# Altium schematic sheet P1.schdoc
size 420 x 297 mm; Symbol: Sheet-Symbol_A4; Company: 嘉立创EDA; Version: V1.0; Page Size: A4; @Project Name: ArmourK08小智音响（1.54寸屏-充电可开关机版); @Page Count: 1; @Update Date: 2025-05-19; @Create Date: 2025-05-09; @Schematic Name: armourk08小智音响（1.54寸屏-充电可开关机版irony)原理图; @Page No: 1; @Page Name: P1; Device: Sheet-Symbol_A4; @Board Name: ArmourK08小智音响（1.54寸屏-充电可开关机版irony); @Create Time: 15:40:17; @Update Time: 10:11:29; Border: 1; Width: 1655; Height: 1170; Region Start: 1; X Region Count: 6; Y Region Count: 4; Blade Width: 10; Title Block Position: 3
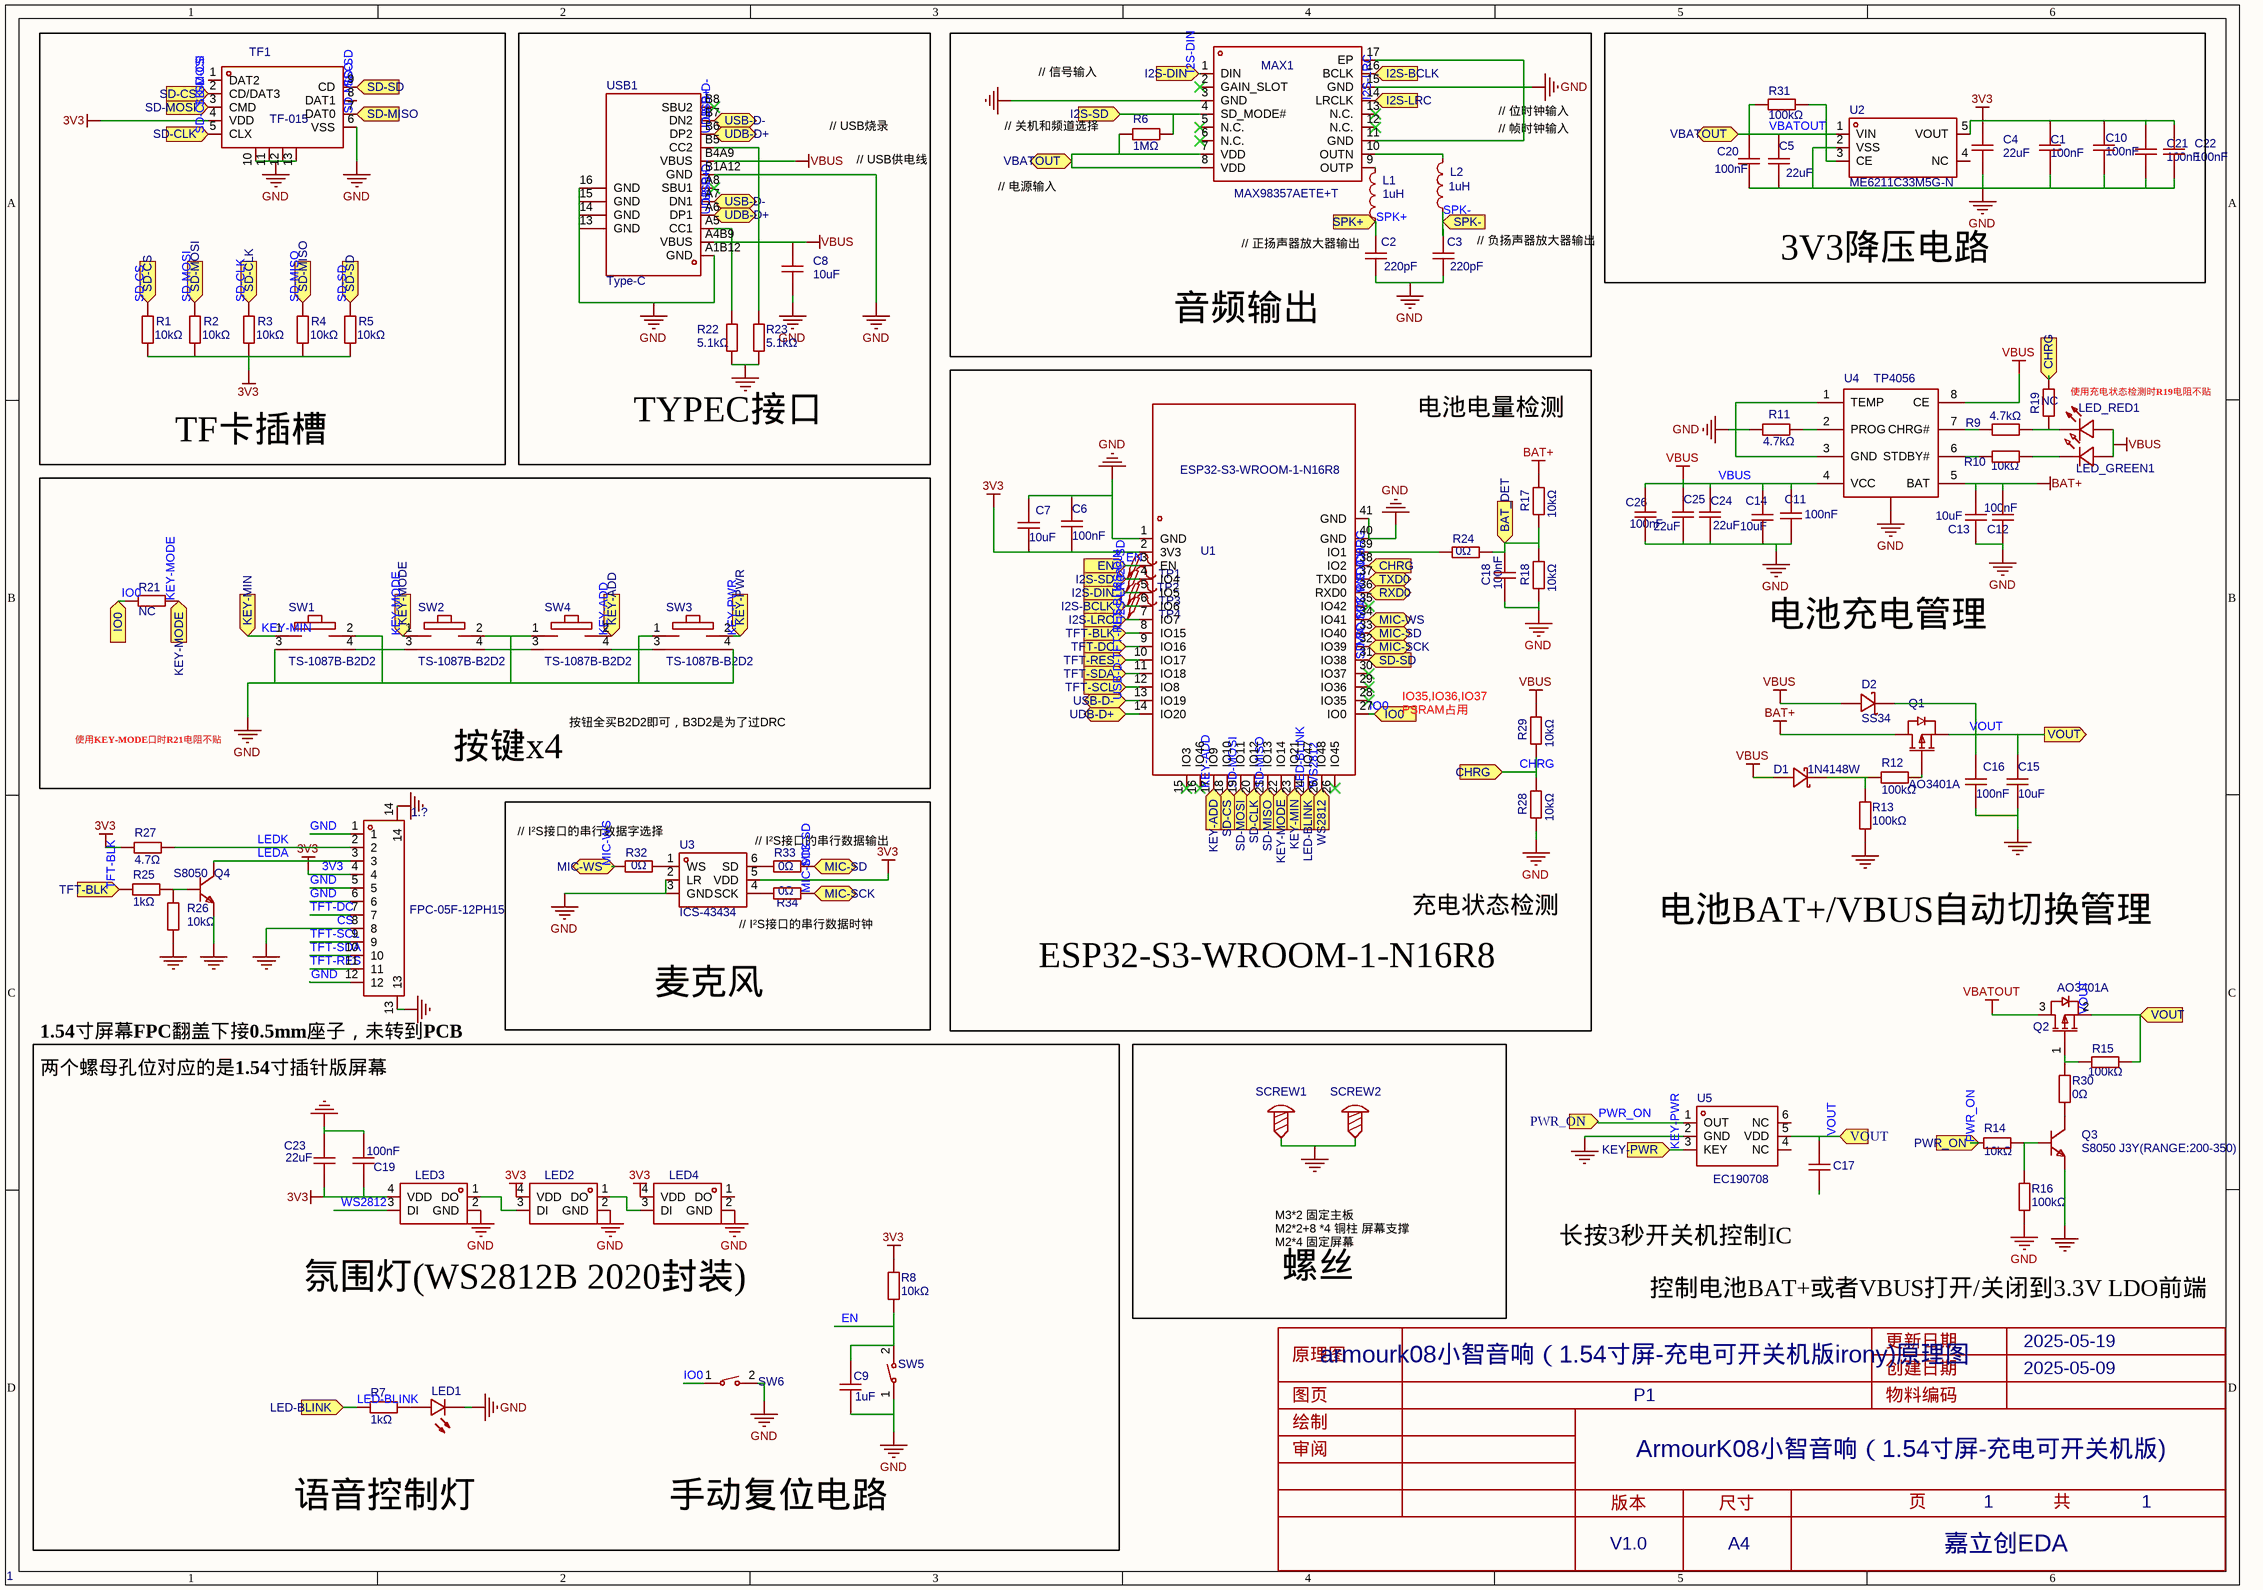
[diagram p0: P1.schdoc]

## Parts
1.?  FPC-05F-12PH15  [FPC-SMD_12P-P0.50_XUNPU_FPC-05F-12PH15]
C1  100nF  [C0603]
C2  220pF  [C0603]
C3  220pF  [C0603]
C4  22uF  [C0805]
C5  22uF  [C0805]
C6  100nF  [C0603]
C7  10uF  [C0603]
C8  10uF  [C0603]
C9  1uF  [C0603]
C10  100nF  [C0603]
C11  100nF  [C0603]
C12  100nF  [C0603]
C13  10uF  [C0805]
C14  10uF  [C0805]
C15  10uF  [C0805]
C16  100nF  [C0603]
C17  CC0603KRX7R9BB104  [C0603]  (value not drawn)
C18  100nF  [C0603]
C19  100nF  [C0603]
C20  100nF  [C0603]
C21  100nF  [C0603]
C22  100nF  [C0603]
C23  22uF  [C0805]
C24  22uF  [C0805]
C25  22uF  [C0805]
C26  100nF  [C0603]
D1  1N4148W  [SOD-123_L2.7-W1.6-LS3.7-FD]
D2  SS34  [SMA_L4.3-W2.6-LS5.2-RD]
L1  1uH  [L0603]
L2  1uH  [L0603]
LED1  NCD0603G1  [LED0603-RD-YELLOW]  (value not drawn)
LED2  WS2812C-2020-V1  [LED-SMD_4P-L2.0-W2.0-TL_WS2812B-2020]  (value not drawn)
LED3  WS2812C-2020-V1  [LED-SMD_4P-L2.0-W2.0-TL_WS2812B-2020]  (value not drawn)
LED4  WS2812C-2020-V1  [LED-SMD_4P-L2.0-W2.0-TL_WS2812B-2020]  (value not drawn)
LED_GREEN1  XL-1608PGC-06  [LED0603-RD_GREEN]  (value not drawn)
LED_RED1  KT-0603R  [LED0603-RD]  (value not drawn)
MAX1  MAX98357AETE+T  [TQFN-16_L3.0-W3.0-P0.50-BL-EP1.1]
Q1  AO3401A  [SOT-23_L2.9-W1.3-P1.90-LS2.4-BR]
Q2  AO3401A  [SOT-23_L2.9-W1.3-P1.90-LS2.4-BR]
Q3  S8050 J3Y(RANGE:200-350)  [SOT-23-3_L3.0-W1.7-P0.95-LS2.9-BR]
Q4  S8050  [SOT-23-3_L2.9-W1.3-P1.90-LS2.3-BR]
R1  10kΩ  [R0603]
R2  10kΩ  [R0603]
R3  10kΩ  [R0603]
R4  10kΩ  [R0603]
R5  10kΩ  [R0603]
R6  1MΩ  [R0603]
R7  1kΩ  [R0603]
R8  10kΩ  [R0603]
R9  4.7kΩ  [R0603]
R10  10kΩ  [R0603]
R11  4.7kΩ  [R0603]
R12  100kΩ  [R0603]
R13  100kΩ  [R0603]
R14  10kΩ  [R0603]
R15  100kΩ  [R0603]
R16  100kΩ  [R0603]
R17  10kΩ  [R0603]
R18  10kΩ  [R0603]
R19  NC  [R0402]
R21  NC  [R0603]
R22  5.1kΩ  [R0603]
R23  5.1kΩ  [R0603]
R24  0Ω  [R0603]
R25  1kΩ  [R0603]
R26  10kΩ  [R0603]
R27  4.7Ω  [R0603]
R28  10kΩ  [R0603]
R29  10kΩ  [R0603]
R30  0Ω  [R0603]
R31  100kΩ  [R0603]
R32  0Ω  [R0603]
R33  0Ω  [R0603]
R34  0Ω  [R0603]
SCREW1  (no value)  [M3螺丝]
SCREW2  (no value)  [M3螺丝]
SW1  TS-1087B-B2D2  [KEY-SMD_4P-L7.8-W2.8-P4.20-EH]
SW2  TS-1087B-B2D2  [KEY-SMD_4P-L7.8-W2.8-P4.20-EH]
SW3  TS-1087B-B2D2  [KEY-SMD_4P-L7.8-W2.8-P4.20-EH]
SW4  TS-1087B-B2D2  [KEY-SMD_4P-L7.8-W2.8-P4.20-EH]
SW5  TC-S3403-2.0-260G  [SW-SMD_L4.0-W3.0-LS5.0]  (value not drawn)
SW6  TC-S3403-2.0-260G  [SW-SMD_L4.0-W3.0-LS5.0]  (value not drawn)
TF1  TF-015  [TF-SMD_TF-015]
TP1  (no value)  [Test-Point-0.5mm]
TP2  (no value)  [Test-Point-0.5mm]
TP3  (no value)  [Test-Point-0.5mm]
TP4  (no value)  [Test-Point-0.5mm]
U1  ESP32-S3-WROOM-1-N16R8  [WIRELM-SMD_ESP32-S3-WROOM-1]
U2  ME6211C33M5G-N  [SOT-23-5_L3.0-W1.7-P0.95-LS2.8-BL]
U3  ICS-43434  [MIC-SMD_6P-L3.5-W2.7-P0.90-BL]
U4  TP4056  [ESOP-8_L4.9-W3.9-P1.27-LS6.0-BL-EP]
U5  EC190708  [SOT-23-6_L2.9-W1.6-P0.95-LS2.8-BL]
USB1  Type-C  [USB-C-SMD_TYPEC-304-BCP16]

## Blocks framed on the sheet
TF卡插槽: R1-R5 TF1
TYPEC接口: C8 R22 R23 USB1
音频输出: C2 C3 L1 L2 MAX1 R6
3V3降压电路: C1 C4 C5 C10 C20-C22 R31 U2
ESP32-S3-WROOM-1-N16R8: C6 C7 C18 R17 R18 R24 R28 R29 TP1-TP4 U1
按键x4: R21 SW1-SW4
麦克风: R32-R34 U3
螺丝: SCREW1 SCREW2

## Ports
BAT_DET (in), CHRG (in), EN (in), I2S-BCLK (in), I2S-DIN (in), I2S-LRC (in), I2S-SD (in), IO0 (in), KEY-ADD (in), KEY-MIN (in), KEY-MODE (in), KEY-PWR (in), LED-BLINK (in), MIC-SCK (bidir), MIC-SD (bidir), MIC-WS (bidir), PWR_ON (in), RXD0 (bidir), SD-CLK (in), SD-CS (in), SD-MISO (in), SD-MOSI (in), SD-SD (in), SPK+ (in), SPK- (in), TFT-BLK (in), TFT-DC (in), TFT-RES (in), TFT-SCL (in), TFT-SDA (in), TXD0 (bidir), UDB-D+ (bidir), USB-D- (bidir), VBATOUT (bidir), VOUT (in), VOUT (out), WS2812 (in)

## Nets
3V3: 1.?.4 C1.2 C4.2 C6.1 C7.1 C10.2 C19.1 C21.2 C22.2 C23.1 LED2.4(VDD) LED3.4(VDD) LED4.4(VDD) R1.1 R2.1 R3.1 R4.1 R5.1 R8.2 R27.1 TF1.4(VDD) U1.2(3V3) U2.5(VOUT) U3.5(VDD)
BAT+: C12.1 C13.1 Q1.3(D) R17.2 U4.5(BAT)
CS: 1.?.1 1.?.5 1.?.6 1.?.8 1.?.12 1.?.13 1.?.14 C1.1 C2.1 C3.1 C4.1 C5.1 C6.2 C7.2 C8.1 C9.1 C10.1 C11.2 C12.2 C13.2 C14.2 C15.1 C16.1 C18.1 C19.2 C20.1 C21.1 C22.1 C23.2 C24.1 C25.1 C26.1 LED1.1(C) LED2.2(GND) LED3.2(GND) LED4.2(GND) MAX1.3(GND) MAX1.11(GND) MAX1.15(GND) MAX1.17(EP) Q3.2(E) Q4.2(E) R11.2 R13.2 R16.2 R18.1 R22.1 R23.1 R26.1 R28.1 SCREW1.1 SCREW2.1 SW1.2 SW1.3 SW1.4 SW2.2 SW2.3 SW2.4 SW3.1 SW3.3 SW3.4 SW4.1 SW4.3 SW4.4 SW5.1 SW6.2 TF1.6(VSS) TF1.10(EP) TF1.11(EP) TF1.12(EP) TF1.13(EP) U1.1(GND) U1.40(GND) U1.41(GND) U2.2(VSS) U3.2(LR) U3.3(GND) U4.1(TEMP) U4.3(GND) U4.9 U5.2(GND) USB1.13(GND) USB1.14(GND) USB1.15(GND) USB1.16(GND) USB1.A1B12(GND) USB1.B1A12(GND)  [also labelled GND]
VBATOUT: C5.2 C20.2 MAX1.7(VDD) MAX1.8(VDD) Q2.3(D) R6.1 R31.2 U2.1(VIN) ; port VBATOUT
VBUS: C8.2 C11.1 C14.1 C24.2 C25.2 C26.2 D1.1(A) D2.2(A) LED_GREEN1.2(A) LED_RED1.2(A) R29.2 U4.4(VCC) U4.8(CE) USB1.A4B9(VBUS) USB1.B4A9(VBUS)
BAT_DET: C18.2 R17.1 R18.2 R24.2 ; port BAT_DET
CHRG: R19.1 R28.2 R29.1 U1.38(IO2) ; port CHRG
EN: C9.2 R8.1 SW5.2 U1.3(EN) ; port EN
I2S-BCLK: MAX1.16(BCLK) TP3.1 U1.6(IO6) ; port I2S-BCLK
I2S-DIN: MAX1.1(DIN) TP2.1 U1.5(IO5) ; port I2S-DIN
I2S-LRC: MAX1.14(LRCLK) TP4.1 U1.7(IO7) ; port I2S-LRC
I2S-SD: MAX1.4(SD_MODE#) R6.2 TP1.1 U1.4(IO4) ; port I2S-SD
IO0: R21.1 SW6.1 U1.27(IO0) ; port IO0
KEY-ADD: SW4.2 U1.17(IO9) ; port KEY-ADD
KEY-MIN: SW1.1 U1.23(IO21) ; port KEY-MIN
KEY-MODE: R21.2 SW2.1 U1.22(IO14) ; port KEY-MODE
KEY-PWR: SW3.2 U5.3(KEY) ; port KEY-PWR
LED-BLINK: R7.1 U1.24(IO47) ; port LED-BLINK
LEDA: 1.?.3 Q4.3(C)
LEDK: 1.?.2 R27.2
MIC-SCK: R34.2 U1.32(IO39) ; port MIC-SCK
MIC-SD: R33.2 U1.33(IO40) ; port MIC-SD
MIC-WS: R32.1 U1.34(IO41) ; port MIC-WS
PWR_ON: R14.1 U5.1(OUT) ; port PWR_ON
RXD0: U1.36(RXD0) ; port RXD0
SD-CLK: R3.2 TF1.5(CLX) U1.20(IO12) ; port SD-CLK
SD-CS: R1.2 TF1.2(CD/DAT3) U1.18(IO10) ; port SD-CS
SD-MISO: R4.2 TF1.7(DAT0) U1.21(IO13) ; port SD-MISO
SD-MOSI: R2.2 TF1.3(CMD) U1.19(IO11) ; port SD-MOSI
SD-SD: R5.2 TF1.9(CD) U1.31(IO38) ; port SD-SD
SPK+: C2.2 L1.1 ; port SPK+
SPK-: C3.2 L2.1 ; port SPK-
TFT-BLK: R25.1 U1.8(IO15) ; port TFT-BLK
TFT-DC: U1.9(IO16) ; port TFT-DC
TFT-DC: 1.?.7  [a separate net that carries the same name]
TFT-RES: 1.?.11 U1.10(IO17) ; port TFT-RES
TFT-SCL: U1.12(IO8) ; port TFT-SCL
TFT-SCL: 1.?.9  [a separate net that carries the same name]
TFT-SDA: U1.11(IO18) ; port TFT-SDA
TFT-SDA: 1.?.10  [a separate net that carries the same name]
TXD0: U1.37(TXD0) ; port TXD0
UDB-D+: U1.14(IO20) USB1.A6(DP1) USB1.B6(DP2) ; port UDB-D+
USB-D-: U1.13(IO19) USB1.A7(DN1) USB1.B7(DN2) ; port USB-D-
VOUT: C15.2 C16.2 C17.1 D2.1(K) Q1.2(S) Q2.2(S) R15.2 U5.5(VDD) ; port VOUT
WS2812: LED3.3(DI) U1.25(IO48) ; port WS2812
NetD1_2: D1.2(K) R12.2 R13.1
NetL1_2: L1.2 MAX1.9(OUTP)
NetL2_2: L2.2 MAX1.10(OUTN)
NetLED1_2: LED1.2(A) R7.2
NetLED2_1: LED2.1(DO) LED4.3(DI)
NetLED2_3: LED2.3(DI) LED3.1(DO)
NetLED_GREEN1_1: LED_GREEN1.1(K) R10.1
NetLED_RED1_1: LED_RED1.1(K) R9.1 R19.2
NetQ1_1: Q1.1(G) R12.1
NetQ2_1: Q2.1(G) R15.1 R30.2
NetQ3_1: Q3.1(B) R14.2 R16.1
NetQ3_3: Q3.3(C) R30.1
NetQ4_1: Q4.1(B) R25.2 R26.2
NetR9_2: R9.2 U4.7(CHRG#)
NetR10_2: R10.2 U4.6(STDBY#)
NetR11_1: R11.1 U4.2(PROG)
NetR22_2: R22.2 USB1.A5(CC1)
NetR23_2: R23.2 USB1.B5(CC2)
NetR24_1: R24.1 U1.39(IO1)
NetR31_1: R31.1 U2.3(CE)
NetR32_2: R32.2 U3.1(WS)
NetR33_1: R33.1 U3.6(SD)
NetR34_1: R34.1 U3.4(SCK)

Not connected (* = marked no-connect by the designer): C17 2; LED4 1(DO); MAX1 2(GAIN_SLOT)* 5(N.C.)* 6(N.C.)* 12(N.C.)* 13(N.C.)*; TF1 1(DAT2) 8(DAT1); U1 15(IO3)* 16(IO46)* 26(IO45)* 28(IO35)* 29(IO36)* 30(IO37)* 35(IO42)*; U2 4(NC); U5 4(NC) 6(NC); USB1 A8(SBU1)* B8(SBU2)*

## Notes on the sheet
- // USB烧录
- // 关机和频道选择
- // 信号输入
- // 位时钟输入
- // USB供电线
- // 电源输入
- // 帧时钟输入
- // 正扬声器放大器输出
- // 负扬声器放大器输出
- 使用充电状态检测时R19电阻不贴
- 电池电量检测
- 电池充电管理
- 按钮全买B2D2即可，B3D2是为了过DRC
- IO35,IO36,IO37
  PSRAM占用
- 使用KEY-MODE口时R21电阻不贴
- (near R32) // I²S接口的串行数据字选择
- // I²S接口的串行数据输出
- // I²S接口的串行数据时钟
- 充电状态检测
- 电池BAT+/VBUS自动切换管理
- 1.54寸屏幕FPC翻盖下接0.5mm座子，未转到PCB
- 两个螺母孔位对应的是1.54寸插针版屏幕
- M3*2 固定主板
  M2*2+8 *4 铜柱 屏幕支撑
  M2*4 固定屏幕
- 长按3秒开关机控制IC
- 氛围灯(WS2812B 2020封装)
- 控制电池BAT+或者VBUS打开/关闭到3.3V LDO前端
- 语音控制灯
- 手动复位电路
- 更新日期
- 2025-05-19
- 原理图
- 图页
- armourk08小智音响（1.54寸屏-充电可开关机版irony)原理图
- P1
- 创建日期
- 物料编码
- 2025-05-09
- 审阅
- 绘制
- ArmourK08小智音响（1.54寸屏-充电可开关机版)
- 版本
- V1.0
- 尺寸
- A4
- 页
- 1
- 嘉立创EDA
- 共

## Library data of the parts
1.? = FPC-05F-12PH15: 锁定特性:翻盖式;触点类型:下接;触点数量:12P;间距:0.5mm;安装类型:卧贴;工作温度范围:-25℃~+85℃;; Manufacturer: XUNPU(讯普); Convert to PCB: no; AddInBom: yes; ModelId: c5b276ae812f4b41b7fd8ec7fca5fefb; ModelTransform: 397.637,192.913,0,0,0,0,-0.001,-33.465,0; Locking Feature: 翻盖式; Number of Contacts: 12P; Pitch: 0.5mm; FFC, FCB Thickness: 0.3mm; Symbol: FPC-05F-12PH15; Device: FPC-05F-12PH15; LCSC Part Name: 间距:0.5mm P数:12P 翻盖式 下接; SupplierPart: C2856817; ManufacturerPart: FPC-05F-12PH15; Supplier Footprint: SMD,P=0.5mm,卧贴; JLCPCB Part Class: Extended Part; Datasheet: https://atta.szlcsc.com/upload/public/pdf/source/20210922/C2856817_FF8E545F713DE01E284DD10C467113AA.pdf; Supplier: LCSC; FootprintName: FPC-SMD_12P-P0.50_XUNPU_FPC-05F-12PH15; ModelName: FPC-SMD_12P-P0.50_XUNPU_FPC-05F-12PH15; Contact Type: 下接; Mounting Type: 卧贴; Height Above Board: 1.5mm; Operating Temperature Range: -25℃~+85℃
C1 C6 C10-C12 C16 C18-C22 = CC0603KRX7R9BB104: 容值:100nF;精度:±10%;额定电压:50V;材质(温度系数):X7R;; Manufacturer: YAGEO(国巨); AddInBom: yes; ModelId: ac125912035d415993ca9572d50418b1; ModelName: C0603_L1.6-W0.8-H0.8; ModelTransform: 62.992,31.496,0,0,0,0,0,0,0; Tolerance: ±10%; Voltage Rated: 50V; Temperature Coefficient: X7R; Symbol: CC0603KRX7R9BB104; Device: CC0603KRX7R9BB104; LCSC Part Name: 100nF ±10% 50V; SupplierPart: C14663; ManufacturerPart: CC0603KRX7R9BB104; Supplier Footprint: 0603; JLCPCB Part Class: Basic Part; Datasheet: https://atta.szlcsc.com/upload/public/pdf/source/20180910/C282072_33301C7F631E79921B82A8DAC6BCC5B3.pdf; Supplier: LCSC; ConvertToPcb: yes; FootprintName: C0603; Value: 100nF
C2 C3 = CL10B221KB8NNNC: 容值:220pF;精度:±10%;额定电压:50V;材质(温度系数):X7R;; Manufacturer: SAMSUNG(三星); AddInBom: yes; ModelId: ac125912035d415993ca9572d50418b1; ModelName: C0603_L1.6-W0.8-H0.8; ModelTransform: 62.992,31.496,0,0,0,0,0,0,0; Tolerance: ±10%; Voltage Rated: 50V; Temperature Coefficient: X7R; Symbol: CL10B221KB8NNNC; Device: CL10B221KB8NNNC; LCSC Part Name: 220pF ±10% 50V; SupplierPart: C1603; ManufacturerPart: CL10B221KB8NNNC; Supplier Footprint: 0603; JLCPCB Part Class: Basic Part; Datasheet: https://atta.szlcsc.com/upload/public/pdf/source/20160218/1457707763339.pdf; Supplier: LCSC; ConvertToPcb: yes; FootprintName: C0603; Value: 220pF
C4 C5 C23-C25 = CL21A226MAQNNNE: 容值:22uF;精度:±20%;额定电压:25V;材质(温度系数):X5R;; Manufacturer: SAMSUNG(三星); AddInBom: yes; ModelId: 1ba041120af144c991958decab20d241; ModelName: C0805_L2.0-W1.3-H1.3; ModelTransform: 78.74,51.181,0,0,0,0,0,0.0005,0; Tolerance: ±20%; Voltage Rated: 25V; Temperature Coefficient: X5R; Symbol: CL21A226MAQNNNE; Device: CL21A226MAQNNNE; LCSC Part Name: 22uF ±20% 25V; SupplierPart: C45783; ManufacturerPart: CL21A226MAQNNNE; Supplier Footprint: 0805; JLCPCB Part Class: Basic Part; Datasheet: https://atta.szlcsc.com/upload/public/pdf/source/20160218/1457707763339.pdf; Supplier: LCSC; ConvertToPcb: yes; FootprintName: C0805; Value: 22uF
C7 = CL10A106KP8NNNC: 容值:10uF;精度:±10%;额定电压:10V;材质(温度系数):X5R;; Manufacturer: SAMSUNG(三星); Symbol: CapAcitance; AddInBom: yes; ModelId: ac125912035d415993ca9572d50418b1; ModelName: C0603_L1.6-W0.8-H0.8; ModelTransform: 62.992,31.496,0,0,0,0,0,0,0; Tolerance: ±10%; Voltage Rated: 10V; Temperature Coefficient: X5R; Device: CL10A106KP8NNNC; LCSC Part Name: 10uF ±10% 10V; SupplierPart: C19702; ManufacturerPart: CL10A106KP8NNNC; Supplier Footprint: 0603; JLCPCB Part Class: Basic Part; Datasheet: https://atta.szlcsc.com/upload/public/pdf/source/20160218/1457707763339.pdf; Supplier: LCSC; ConvertToPcb: yes; FootprintName: C0603; Value: 10uF
C8 = CL10A106KP8NNNC: 容值:10uF;精度:±10%;额定电压:10V;材质(温度系数):X5R;; Manufacturer: SAMSUNG(三星); AddInBom: yes; ModelId: ac125912035d415993ca9572d50418b1; ModelName: C0603_L1.6-W0.8-H0.8; ModelTransform: 62.992,31.496,0,0,0,0,0,0,0; Tolerance: ±10%; Voltage Rated: 10V; Temperature Coefficient: X5R; Symbol: CL10A106KP8NNNC; Device: CL10A106KP8NNNC; LCSC Part Name: 10uF ±10% 10V; SupplierPart: C19702; ManufacturerPart: CL10A106KP8NNNC; Supplier Footprint: 0603; JLCPCB Part Class: Basic Part; Datasheet: https://atta.szlcsc.com/upload/public/pdf/source/20160218/1457707763339.pdf; Supplier: LCSC; ConvertToPcb: yes; FootprintName: C0603; Value: 10uF
C9 = CL10A105KB8NNNC: 容值:1uF;精度:±10%;额定电压:50V;材质(温度系数):X5R;; Manufacturer: SAMSUNG(三星); AddInBom: yes; ModelId: ac125912035d415993ca9572d50418b1; ModelName: C0603_L1.6-W0.8-H0.8; ModelTransform: 62.992,31.496,0,0,0,0,0,0,0; Tolerance: ±10%; Voltage Rated: 50V; Temperature Coefficient: X5R; Symbol: CL10A105KB8NNNC; Device: CL10A105KB8NNNC; LCSC Part Name: 1uF ±10% 50V; SupplierPart: C15849; ManufacturerPart: CL10A105KB8NNNC; Supplier Footprint: 0603; JLCPCB Part Class: Basic Part; Datasheet: https://atta.szlcsc.com/upload/public/pdf/source/20160218/1457707763339.pdf; Supplier: LCSC; ConvertToPcb: yes; FootprintName: C0603; Value: 1uF
C13 C14 = GRM21BR61H106KE43L: 容值:10uF;精度:±10%;额定电压:50V;材质(温度系数):X5R;; Manufacturer: muRata(村田); Symbol: C1210X7R475K630NT; AddInBom: yes; ModelId: 1ba041120af144c991958decab20d241; ModelName: C0805_L2.0-W1.3-H1.3; ModelTransform: 78.74,51.181,0,0,0,0,0,0.0005,0; Tolerance: ±10%; Voltage Rated: 50V; Temperature Coefficient: X5R; Device: GRM21BR61H106KE43L; Supplier Part: C440198; LCSC Part Name: 10uF ±10% 50V; ManufacturerPart: GRM21BR61H106KE43L; Supplier Footprint: 0805; JLCPCB Part Class: Basic Part; Datasheet: https://atta.szlcsc.com/upload/public/pdf/source/20230811/95AAE0C9AF55EDC31B7A4D8B733F534E.pdf; Supplier: LCSC; ConvertToPcb: yes; FootprintName: C0805; Value: 10uF
C15 = GRM21BR61H106KE43L: 容值:10uF;精度:±10%;额定电压:50V;材质(温度系数):X5R;; Manufacturer: muRata(村田); AddInBom: yes; ModelId: 1ba041120af144c991958decab20d241; ModelName: C0805_L2.0-W1.3-H1.3; ModelTransform: 78.74,51.181,0,0,0,0,0,0.0005,0; Tolerance: ±10%; Voltage Rated: 50V; Temperature Coefficient: X5R; Symbol: GRM21BR61H106KE43L; Value: 10uF; Device: GRM21BR61H106KE43L; Supplier Part: C440198; Manufacturer Part: GRM21BR61H106KE43L; JLCPCB Part Class: Basic Part; Supplier: LCSC; LCSC Part Name: 10uF ±10% 50V; Supplier Footprint: 0805; Datasheet: https://atta.szlcsc.com/upload/public/pdf/source/20230811/95AAE0C9AF55EDC31B7A4D8B733F534E.pdf; ConvertToPcb: yes; FootprintName: C0805
C17 = CC0603KRX7R9BB104: 容值:100nF;精度:±10%;额定电压:50V;材质(温度系数):X7R;; Manufacturer: YAGEO(国巨); AddInBom: yes; ModelId: ac125912035d415993ca9572d50418b1; ModelName: C0603_L1.6-W0.8-H0.8; ModelTransform: 62.992,31.496,0,0,0,0,0,0,0; Value: 100nF; Tolerance: ±10%; Voltage Rated: 50V; Temperature Coefficient: X7R; Origin Footprint: C0603; Device: CC0603KRX7R9BB104; Symbol: CC0603KRX7R9BB104; LCSC Part Name: 100nF ±10% 50V; SupplierPart: C14663; ManufacturerPart: CC0603KRX7R9BB104; Supplier Footprint: 0603; JLCPCB Part Class: Basic Part; Datasheet: https://atta.szlcsc.com/upload/public/pdf/source/20180910/C282072_33301C7F631E79921B82A8DAC6BCC5B3.pdf; Supplier: LCSC; ConvertToPcb: yes; FootprintName: C0603
C26 = CC0603KRX7R9BB104: 容值:100nF;精度:±10%;额定电压:50V;材质(温度系数):X7R;; Manufacturer: YAGEO(国巨); Symbol: CL10A105KB8NNNC; AddInBom: yes; ModelId: ac125912035d415993ca9572d50418b1; ModelName: C0603_L1.6-W0.8-H0.8; ModelTransform: 62.992,31.496,0,0,0,0,0,0,0; Tolerance: ±10%; Voltage Rated: 50V; Temperature Coefficient: X7R; Device: CC0603KRX7R9BB104; LCSC Part Name: 100nF ±10% 50V; SupplierPart: C14663; ManufacturerPart: CC0603KRX7R9BB104; Supplier Footprint: 0603; JLCPCB Part Class: Basic Part; Datasheet: https://atta.szlcsc.com/upload/public/pdf/source/20180910/C282072_33301C7F631E79921B82A8DAC6BCC5B3.pdf; Supplier: LCSC; ConvertToPcb: yes; FootprintName: C0603; Value: 100nF
D1 = 1N4148W_C7420318: 二极管配置:独立式;正向压降(Vf):1.25V@150mA;直流反向耐压(Vr):100V;整流电流:150mA;反向恢复时间(trr):4ns;; Manufacturer: 宏迦橙; Symbol: B5819W_C7420330; AddInBom: yes; ModelId: 5054d9b7be8b429dad093a54b517b4dd; ModelTransform: 145.669,61.024,0,0,0,0,0,0,0; Diode Configuration: 独立式; Reverse Voltage (Vr): 100V; Rectified Current: 150mA; Reverse Leakage Current (Ir): 1uA@75V; Reverse Recovery Time (trr): 4ns; Device: 1N4148W_C7420318; Supplier: LCSC; Supplier Part: C7420318; Manufacturer Part: 1N4148W; JLCPCB Part Class: Extended Part; LCSC Part Name: 1N4148W; Supplier Footprint: SOD-123; Datasheet: https://atta.szlcsc.com/upload/public/pdf/source/20230828/E5C3F7A4272052930A7E03B75759BF50.pdf; ConvertToPcb: yes; FootprintName: SOD-123_L2.7-W1.6-LS3.7-FD; ModelName: SOD-123_L2.7-W1.6-LS3.7-FD; Forward Voltage (Vf@If): 1.25V@150mA; Operating Temperature: -55℃~+150℃
D2 = SS34_C8678: 二极管配置:独立式;正向压降(Vf):550mV@3A;直流反向耐压(Vr):40V;整流电流:3A;; Manufacturer: MDD(辰达半导体); AddInBom: yes; ModelId: e3551acb3c5a4975a5e9d36087fe1fa2; ModelTransform: 185.039,102.362,0,0,0,0,0,0,0; Diode Configuration: 独立式; Reverse Voltage (Vr): 40V; Rectified Current: 3A; Reverse Leakage Current (Ir): 500uA@40V; Supplier: LCSC; Supplier Part: C8678; Manufacturer Part: SS34; JLCPCB Part Class: Basic Part; Symbol: SS34_C8678; Device: SS34_C8678; LCSC Part Name: 电压:40V 电流:3A; Supplier Footprint: SMA(DO-214AC); Datasheet: https://atta.szlcsc.com/upload/public/pdf/source/20240710/2118BB86FDDB2E0B294389AC1F3F65C8.pdf; ConvertToPcb: yes; FootprintName: SMA_L4.3-W2.6-LS5.2-RD; ModelName: SMA_L4.3-W2.6-LS5.2-RD; Forward Voltage (Vf@If): 550mV@3A
L1 L2 = MLF1608A1R0JT000: 电感值:1uH;精度:±5%;额定电流:50mA;饱和电流(Isat):-;直流电阻(DCR):250mΩ;; Manufacturer: TDK; AddInBom: yes; ModelId: 2bc5ec593d464d6ba9807aec0b5673c2; ModelName: L0603_L1.6-W0.8-H0.5_BEAD; ModelTransform: 62.992,31.496,0,180,0,0,0.094,0.629,0; Tolerance: ±5%; Rated Current: 50mA; DC Resistance (DCR): 250mΩ; Q @ Freq: 35@10MHz; Frequency - Self Resonant: 120MHz; Symbol: MLF1608A1R0JT000; Device: MLF1608A1R0JT000; LCSC Part Name: 1uH ±5%; SupplierPart: C275338; ManufacturerPart: MLF1608A1R0JT000; Supplier Footprint: 0603; JLCPCB Part Class: Extended Part; Datasheet: https://atta.szlcsc.com/upload/public/pdf/source/20181024/C275360_B1B692DBFC9DEC74C665E44402F50225.pdf; Supplier: LCSC; ConvertToPcb: yes; FootprintName: L0603; Value: 1uH; Saturation Current (Isat): -; Ratings: -
LED1 = NCD0603G1: 发光颜色:翠绿色;正向电压(VF):2.6V~3.6V;功率:72mW;正向电流:10mA;主波长:515nm~530nm;透镜颜色:无色透明透镜;发光强度:330mcd~900mcd;发光角度:130°;工作温度:-30℃~+85℃;; Manufacturer: 国星光电; Symbol: 19-213/Y2C-CQ2R2L/3T(CY); AddInBom: yes; ModelId: 3beb0148d24d477aac1d9f7d4b6d534c; ModelName: LED0603-RD_1; ModelTransform: 62.2046,31.496,0,0,0,0,0.002,0.007,0; Emitted Color: 翠绿色; Power Dissipation: 72mW; Forward Current: 10mA; Lens Color: 无色透明透镜; Viewing Angle: 130°; Device: NCD0603G1; LCSC Part Name: NCD0603G1; SupplierPart: C84267; ManufacturerPart: NCD0603G1; Supplier Footprint: 0603; JLCPCB Part Class: Extended Part; Datasheet: https://atta.szlcsc.com/upload/public/pdf/source/20200820/C84267_04BA7703640BAC111D09F5EFB971FBF3.pdf; Supplier: LCSC; ConvertToPcb: yes; FootprintName: LED0603-RD-YELLOW; Forward Voltage (VF): 2.6V~3.6V; Dominant Wavelength: 515nm~530nm; Luminous Intensity: 330mcd~900mcd; Operating Temperature: -30℃~+85℃
LED2-LED4 = WS2812C-2020-V1: 发光颜色:RGB三色;功率:-;正向电流:-;主波长:624nm；520nm；467nm;二极管配置:-;透镜颜色:-;色温:-;发光角度:-;载带方式:-;工作温度:-;; Manufacturer: worldsemi; AddInBom: yes; ModelId: ec3f1773c2c342958c28fcec35b8a247; ModelName: LED-SMD_4P-L2.0-W2.0-H0.8-TL_WS2812B-2020; ModelTransform: 78.74,78.74,0,0,0,0,0.001,0.005,0; Emitted Color: RGB三色; Symbol: WS2812C-2020-V1; Device: WS2812C-2020-V1; LCSC Part Name: RGB三色; SupplierPart: C2976072; ManufacturerPart: WS2812C-2020-V1; Supplier Footprint: SMD,2x2mm; JLCPCB Part Class: 扩展库; Datasheet: https://atta.szlcsc.com/upload/public/pdf/source/20220222/52A01000447F5320C9A8C3F34CEFDB81.pdf; Supplier: LCSC; ConvertToPcb: yes; FootprintName: LED-SMD_4P-L2.0-W2.0-TL_WS2812B-2020; Power Dissipation: -; Forward Current: -; Dominant Wavelength: 624nm；520nm；467nm; Peak Wavelength: -; Diode Configuration: -; Lens Color: -; Color Temperature: -; Viewing Angle: -; Mounting Sytle: -; Operating Temperature: -
LED_GREEN1 = XL-1608PGC-06: 灯头类型:-;发光颜色:翠绿色;正向电压(VF):2.6V~3V;功率:75mW;正向电流:5mA;主波长:505nm~540nm;二极管配置:-;透镜颜色:绿色透镜;色温:-;发光强度:299mcd;发光角度:130°;载带方式:正贴;工作温度:-;; Manufacturer: XINGLIGHT(成兴光); Origin Footprint: LED0603_GREEN; AddInBom: yes; ModelId: 7761174b67d9475ab0dbce38062fb2f9; ModelTransform: 63.7794,31.496,0,0,0,0,0,0,0; Emitted Color: 翠绿色; Power Dissipation: 75mW; Forward Current: 5mA; Peak Wavelength: 530nm; Lens Color: 绿色透镜; Luminous Intensity: 299mcd; Viewing Angle: 130°; Mounting Sytle: 正贴; Device: XL-1608PGC-06; Symbol: XL-1608PGC-06; LCSC Part Name: XL-1608PGC-06; SupplierPart: C7371905; ManufacturerPart: XL-1608PGC-06; Supplier Footprint: 0603; JLCPCB Part Class: Extended Part; Datasheet: https://atta.szlcsc.com/upload/public/pdf/source/20240218/2F8A7AF596DEEB38157DAB7856E382C0.pdf; Supplier: LCSC; ConvertToPcb: yes; FootprintName: LED0603-RD_GREEN; ModelName: LED0603-RD_GREEN; Lamp Holder Type: -; Forward Voltage (VF): 2.6V~3V; Dominant Wavelength: 505nm~540nm; Diode Configuration: -; Color Temperature: -; Operating Temperature: -
LED_RED1 = KT-0603R: 发光颜色:红色;功率:-;正向电流:-;主波长:-;二极管配置:-;透镜颜色:-;色温:-;发光角度:-;载带方式:-;工作温度:-40℃~+85℃;; Manufacturer: KENTO; Origin Footprint: LED0603_RED; AddInBom: yes; ModelId: 1f0d29a91be547639d425604e9b96ebb; ModelTransform: 63.7794,32.283,0,0,0,0,0,0,0; Emitted Color: 红色; Device: KT-0603R; Symbol: KT-0603R; LCSC Part Name: 0603 红灯 高亮; SupplierPart: C2286; ManufacturerPart: KT-0603R; Supplier Footprint: 0603; JLCPCB Part Class: Basic Part; Datasheet: https://atta.szlcsc.com/upload/public/pdf/source/20160616/1466072038404.pdf; Supplier: LCSC; ConvertToPcb: yes; FootprintName: LED0603-RD; ModelName: LED0603-RD; Power Dissipation: -; Forward Current: -; Dominant Wavelength: -; Peak Wavelength: -; Diode Configuration: -; Lens Color: -; Color Temperature: -; Viewing Angle: -; Mounting Sytle: -; Operating Temperature: -40℃~+85℃
MAX1 = MAX98357AETE+T_C20745475: AddInBom: yes; ModelId: d03e2740da5b4301843821a0a2c070ec; ModelTransform: 118.11,118.11,0,0,0,0,0,0,0; Symbol: MAX98357AETE+T_C20745475; Device: MAX98357AETE+T_C20745475; LCSC Part Name: MAX98357AETE+T; SupplierPart: C20745475; ManufacturerPart: MAX98357AETE+T; Supplier Footprint: TQFN-16; JLCPCB Part Class: 扩展库; Supplier: LCSC; ConvertToPcb: yes; FootprintName: TQFN-16_L3.0-W3.0-P0.50-BL-EP1.1; ModelName: TQFN-16_L3.0-W3.0-P0.50-BL-EP1.1
Q1 = AO3401A_C15127: 类型:P沟道;漏源电压(Vdss):30V;连续漏极电流(Id):4A;功率(Pd):1.4W;导通电阻(RDS(on)@Vgs,Id):44mΩ@10V,4.3A;阈值电压(Vgs(th)@Id):1.3V@250uA;; Manufacturer: AOS; AddInBom: yes; ModelId: c62791f0466c4ae2a892c056b845b0ca; ModelName: SOT-23-3P_L2.9-W1.3-H1.0-LS2.4-P0.95; ModelTransform: 98.64468,114.173,0,180,0,0,0,0,0; Type: P沟道; Drain Source Voltage (Vdss): 30V; Continuous Drain Current (Id): 4A; Power Dissipation (Pd): 1.4W; Total Gate Charge (Qg@Vgs): 12.2nC@4.5V; Input Capacitance (Ciss@Vds): 1.2nF@15V; Device: AO3401A_C15127; Symbol: AO3401A; LCSC Part Name: P沟道 耐压:30V 电流:4A; SupplierPart: C15127; ManufacturerPart: AO3401A; Supplier Footprint: SOT-23; Datasheet: https://atta.szlcsc.com/upload/public/pdf/source/20160507/1462613609053.pdf; Supplier: LCSC; ConvertToPcb: yes; FootprintName: SOT-23_L2.9-W1.3-P1.90-LS2.4-BR; Drain Source On Resistance (RDS(on)@Vgs,Id): 44mΩ@10V,4.3A; Gate Threshold Voltage (Vgs(th)@Id): 1.3V@250uA; Operating Temperature: -55℃~+150℃@(Tj)
Q2 = AO3401A_C15127: 类型:1个P沟道;漏源电压(Vdss):30V;连续漏极电流(Id):4A;导通电阻(RDS(on)@Vgs,Id):44mΩ@10V,4.3A;功率(Pd):1.4W;阈值电压(Vgs(th)@Id):1.3V@250uA;; Manufacturer: AOS; Symbol: WPM2341-3/TR; AddInBom: yes; ModelId: c62791f0466c4ae2a892c056b845b0ca; ModelName: SOT-23-3P_L2.9-W1.3-H1.0-LS2.4-P0.95; ModelTransform: 98.64468,114.173,0,180,0,0,0,0,0; Type: P沟道; Drain Source Voltage (Vdss): 30V; Continuous Drain Current (Id): 4A; Power Dissipation (Pd): 1.4W; Total Gate Charge (Qg@Vgs): 12.2nC@4.5V; Input Capacitance (Ciss@Vds): 1.2nF@15V; Device: AO3401A_C15127; Supplier: LCSC; Supplier Part: C15127; Manufacturer Part: AO3401A; JLCPCB Part Class: Basic Part; LCSC Part Name: P沟道 耐压:30V 电流:4A; Supplier Footprint: SOT-23; Datasheet: https://atta.szlcsc.com/upload/public/pdf/source/20160507/1462613609053.pdf; ConvertToPcb: yes; FootprintName: SOT-23_L2.9-W1.3-P1.90-LS2.4-BR; Drain Source On Resistance (RDS(on)@Vgs,Id): 44mΩ@10V,4.3A; Gate Threshold Voltage (Vgs(th)@Id): 1.3V@250uA; Operating Temperature: -55℃~+150℃@(Tj)
Q3 = S8050 J3Y(RANGE:200-350): 晶体管类型:NPN;集电极电流(Ic):500mA;集射极击穿电压(Vceo):25V;耗散功率(Pd):300mW;直流电流增益(hFE):200@500mA,1V;; Manufacturer: CJ(江苏长电/长晶); Symbol: S8050_C2146; AddInBom: yes; ModelId: 89cb27a44ab2466697082bb9fd73a7d0; ModelName: SOT-23-3L_L2.9-W1.6-H1.1-LS2.8-P0.95; ModelTransform: 114.173,110.236,0,90,0,0,0,0,0; type: NPN; Current - Collector(Ic): 500mA; Collector - Emitter Voltage VCEO: 25V; Pd - Power Dissipation: 300mW; Transition frequency(fT): 150MHz; Current - Collector Cutoff: 100nA; Vce Saturation(VCE(sat)): 600mV; Device: S8050 J3Y(RANGE:200-350); LCSC Part Name: H档(200-350); SupplierPart: C2146; ManufacturerPart: S8050 J3Y(RANGE:200-350); Supplier Footprint: SOT-23; JLCPCB Part Class: Basic Part; Datasheet: https://atta.szlcsc.com/upload/public/pdf/source/20231013/FF37B6A000E6CDA75C9C999D2E78731F.pdf; Supplier: LCSC; ConvertToPcb: yes; FootprintName: SOT-23-3_L3.0-W1.7-P0.95-LS2.9-BR; DC Current Gain: 200@500mA,1V; Operating Temperature: -55℃~+150℃
Q4 = S8050_C20069125: 晶体管类型:NPN;集电极电流(Ic):500mA;集射极击穿电压(Vceo):25V;耗散功率(Pd):300mW;直流电流增益(hFE):120@50mA,1.0V;; Manufacturer: 宏嘉诚; Convert to PCB: no; AddInBom: yes; ModelId: 5504beb8757f4de79731898ec55d3e54; ModelTransform: 114.173,90.551,0,90,0,0,0,0,0; type: NPN; Current - Collector(Ic): 500mA; Collector - Emitter Voltage VCEO: 25V; Pd - Power Dissipation: 300mW; Transition frequency(fT): 100MHz; Current - Collector Cutoff: 100nA; Vce Saturation(VCE(sat)): 600mV; Symbol: S8050_C20069125; Device: S8050_C20069125; LCSC Part Name: hFE:200-350，丝印:J3Y S8050; SupplierPart: C20069125; ManufacturerPart: S8050; Supplier Footprint: SOT-23; JLCPCB Part Class: 扩展库; Datasheet: https://atta.szlcsc.com/upload/public/pdf/source/20250107/343E8B94B5C24D0D65D7D4B70E0B73F6.pdf; Supplier: LCSC; FootprintName: SOT-23-3_L2.9-W1.3-P1.90-LS2.3-BR; ModelName: SOT-23-3_L2.9-W1.3-P1.90-LS2.3-BR; DC Current Gain: 120@50mA,1.0V; Operating Temperature: -55℃~+150℃
R1-R5 = 0603WAF1002T5E: 电阻类型:厚膜电阻;阻值:10kΩ;精度:±1%;功率:100mW;最大工作电压:75V;温度系数:±100ppm/℃;; Manufacturer: UNI-ROYAL(厚声); AddInBom: yes; ModelId: fc143cca1e79419f9cd78b61e9279f08; ModelTransform: 31.8897,63.7794,0,90,0,0,0,0,0; Tolerance: ±1%; Power(Watts): 100mW; Overload Voltage (Max): 75V; Symbol: 0603WAF1002T5E; Device: 0603WAF1002T5E; LCSC Part Name: 厚膜电阻 10kΩ ±1% 100mW; SupplierPart: C25804; ManufacturerPart: 0603WAF1002T5E; Supplier Footprint: 0603; JLCPCB Part Class: Basic Part; Datasheet: https://atta.szlcsc.com/upload/public/pdf/source/20200306/C422600_1E6D84923E4A46A82E41ADD87F860B5C.pdf; Supplier: LCSC; ConvertToPcb: yes; FootprintName: R0603; ModelName: R0603; Type: 厚膜电阻; Value: 10kΩ; Temperature Coefficient: ±100ppm/℃; Operating Temperature Range: -55℃~+155℃
R6 = 0603WAF1004T5E: 电阻类型:厚膜电阻;阻值:1MΩ;精度:±1%;功率:100mW;最大工作电压:75V;温度系数:±100ppm/℃;; Manufacturer: UNI-ROYAL(厚声); AddInBom: yes; ModelId: fc143cca1e79419f9cd78b61e9279f08; ModelTransform: 31.8897,63.7794,0,90,0,0,0,0,0; Tolerance: ±1%; Power(Watts): 100mW; Overload Voltage (Max): 75V; Symbol: 0603WAF1004T5E; Device: 0603WAF1004T5E; LCSC Part Name: 1MΩ ±1% 100mW 厚膜电阻; SupplierPart: C22935; ManufacturerPart: 0603WAF1004T5E; Supplier Footprint: 0603; JLCPCB Part Class: 基础库; Datasheet: https://atta.szlcsc.com/upload/public/pdf/source/20200306/C422600_1E6D84923E4A46A82E41ADD87F860B5C.pdf; Supplier: LCSC; ConvertToPcb: yes; FootprintName: R0603; ModelName: R0603; Type: 厚膜电阻; Value: 1MΩ; Temperature Coefficient: ±100ppm/℃; Operating Temperature Range: -55℃~+155℃
R7 = 0603WAF1001T5E: 电阻类型:厚膜电阻;阻值:1kΩ;精度:±1%;功率:100mW;最大工作电压:75V;温度系数:±100ppm/℃;; Manufacturer: UNI-ROYAL(厚声); Symbol: ACD03K102JT; AddInBom: yes; ModelId: fc143cca1e79419f9cd78b61e9279f08; ModelTransform: 31.8897,63.7794,0,90,0,0,0,0,0; Tolerance: ±1%; Power(Watts): 100mW; Overload Voltage (Max): 75V; Device: 0603WAF1001T5E; LCSC Part Name: 1kΩ ±1% 100mW 厚膜电阻; SupplierPart: C21190; ManufacturerPart: 0603WAF1001T5E; Supplier Footprint: 0603; JLCPCB Part Class: Basic Part; Datasheet: https://atta.szlcsc.com/upload/public/pdf/source/20200306/C422600_1E6D84923E4A46A82E41ADD87F860B5C.pdf; Supplier: LCSC; ConvertToPcb: yes; FootprintName: R0603; ModelName: R0603; Type: 厚膜电阻; Value: 1kΩ; Temperature Coefficient: ±100ppm/℃; Operating Temperature Range: -55℃~+155℃
R8 = 0603WAF1002T5E: 电阻类型:厚膜电阻;阻值:10kΩ;精度:±1%;功率:100mW;最大工作电压:75V;温度系数:±100ppm/℃;; Manufacturer: UNI-ROYAL(厚声); Symbol: ACD03K1002FT; AddInBom: yes; ModelId: fc143cca1e79419f9cd78b61e9279f08; ModelTransform: 31.8897,63.7794,0,90,0,0,0,0,0; Tolerance: ±1%; Power(Watts): 100mW; Overload Voltage (Max): 75V; Device: 0603WAF1002T5E; LCSC Part Name: 厚膜电阻 10kΩ ±1% 100mW; SupplierPart: C25804; ManufacturerPart: 0603WAF1002T5E; Supplier Footprint: 0603; JLCPCB Part Class: Basic Part; Datasheet: https://atta.szlcsc.com/upload/public/pdf/source/20200306/C422600_1E6D84923E4A46A82E41ADD87F860B5C.pdf; Supplier: LCSC; ConvertToPcb: yes; FootprintName: R0603; ModelName: R0603; Type: 厚膜电阻; Value: 10kΩ; Temperature Coefficient: ±100ppm/℃; Operating Temperature Range: -55℃~+155℃
R9 = 0603WAF4701T5E: 电阻类型:厚膜电阻;阻值:4.7kΩ;精度:±1%;功率:100mW;最大工作电压:75V;温度系数:±100ppm/℃;; Manufacturer: UNI-ROYAL(厚声); Symbol: 0402WGF4701TCE; AddInBom: yes; ModelId: fc143cca1e79419f9cd78b61e9279f08; ModelTransform: 31.8897,63.7794,0,90,0,0,0,0,0; Tolerance: ±1%; Power(Watts): 100mW; Overload Voltage (Max): 75V; Device: 0603WAF4701T5E; Supplier Part: C23162; LCSC Part Name: 4.7kΩ ±1% 100mW 厚膜电阻; ManufacturerPart: 0603WAF4701T5E; Supplier Footprint: 0603; JLCPCB Part Class: Basic Part; Datasheet: https://atta.szlcsc.com/upload/public/pdf/source/20200306/C422600_1E6D84923E4A46A82E41ADD87F860B5C.pdf; Supplier: LCSC; ConvertToPcb: yes; FootprintName: R0603; ModelName: R0603; Type: 厚膜电阻; Value: 4.7kΩ; Temperature Coefficient: ±100ppm/℃; Operating Temperature Range: -55℃~+155℃
R10 R14 R17 R18 R28 R29 = 0603WAF1002T5E: 电阻类型:厚膜电阻;阻值:10kΩ;精度:±1%;功率:100mW;最大工作电压:75V;温度系数:±100ppm/℃;; Manufacturer: UNI-ROYAL(厚声); Symbol: 0402WGF1002TCE; AddInBom: yes; ModelId: fc143cca1e79419f9cd78b61e9279f08; ModelTransform: 31.8897,63.7794,0,90,0,0,0,0,0; Tolerance: ±1%; Power(Watts): 100mW; Overload Voltage (Max): 75V; Device: 0603WAF1002T5E; LCSC Part Name: 厚膜电阻 10kΩ ±1% 100mW; SupplierPart: C25804; ManufacturerPart: 0603WAF1002T5E; Supplier Footprint: 0603; JLCPCB Part Class: Basic Part; Datasheet: https://atta.szlcsc.com/upload/public/pdf/source/20200306/C422600_1E6D84923E4A46A82E41ADD87F860B5C.pdf; Supplier: LCSC; ConvertToPcb: yes; FootprintName: R0603; ModelName: R0603; Type: 厚膜电阻; Value: 10kΩ; Temperature Coefficient: ±100ppm/℃; Operating Temperature Range: -55℃~+155℃
R11 = 0603WAF4701T5E: 电阻类型:厚膜电阻;阻值:4.7kΩ;精度:±1%;功率:100mW;最大工作电压:75V;温度系数:±100ppm/℃;; Manufacturer: UNI-ROYAL(厚声); Symbol: RC0402FR-071K2L; AddInBom: yes; ModelId: fc143cca1e79419f9cd78b61e9279f08; ModelTransform: 31.8897,63.7794,0,90,0,0,0,0,0; Tolerance: ±1%; Power(Watts): 100mW; Overload Voltage (Max): 75V; Value: 4.7kΩ; Device: 0603WAF4701T5E; Supplier Part: C23162; LCSC Part Name: 4.7kΩ ±1% 100mW 厚膜电阻; ManufacturerPart: 0603WAF4701T5E; Supplier Footprint: 0603; JLCPCB Part Class: Basic Part; Datasheet: https://atta.szlcsc.com/upload/public/pdf/source/20200306/C422600_1E6D84923E4A46A82E41ADD87F860B5C.pdf; Supplier: LCSC; ConvertToPcb: yes; FootprintName: R0603; ModelName: R0603; Type: 厚膜电阻; Temperature Coefficient: ±100ppm/℃; Operating Temperature Range: -55℃~+155℃
R12 R13 R15 R16 R31 = 0603WAF1003T5E: 电阻类型:厚膜电阻;阻值:100kΩ;精度:±1%;功率:100mW;最大工作电压:75V;温度系数:±100ppm/℃;; Manufacturer: UNI-ROYAL(厚声); Symbol: 0402WGF1003TCE; AddInBom: yes; ModelId: fc143cca1e79419f9cd78b61e9279f08; ModelTransform: 31.8897,63.7794,0,90,0,0,0,0,0; Tolerance: ±1%; Power(Watts): 100mW; Overload Voltage (Max): 75V; Value: 100kΩ; Device: 0603WAF1003T5E; Supplier Part: C25803; Manufacturer Part: 0603WAF1003T5E; JLCPCB Part Class: Basic Part; Supplier: LCSC; LCSC Part Name: 100kΩ ±1% 100mW 厚膜电阻; Supplier Footprint: 0603; Datasheet: https://atta.szlcsc.com/upload/public/pdf/source/20200306/C422600_1E6D84923E4A46A82E41ADD87F860B5C.pdf; ConvertToPcb: yes; FootprintName: R0603; ModelName: R0603; Type: 厚膜电阻; Temperature Coefficient: ±100ppm/℃; Operating Temperature Range: -55℃~+155℃
R19 = 0402WGF4701TCE: 电阻类型:厚膜电阻;阻值:4.7kΩ;精度:±1%;功率:62.5mW;最大工作电压:50V;温度系数:±100ppm/℃;; Manufacturer: UNI-ROYAL(厚声); AddInBom: yes; ModelId: 98c88bc2b9094f218f3a3e30a7012738; ModelName: R0402_L1.0-W0.5-H0.4; ModelTransform: 39.37,19.685,0,0,0,0,0,0,0; Tolerance: ±1%; Power(Watts): 62.5mW; Overload Voltage (Max): 50V; Value: NC; Symbol: 0402WGF4701TCE; Device: 0402WGF4701TCE; LCSC Part Name: 4.7kΩ ±1% 62.5mW 厚膜电阻; ManufacturerPart: 0402WGF4701TCE; Supplier Footprint: 0402; JLCPCB Part Class: Basic Part; Datasheet: https://atta.szlcsc.com/upload/public/pdf/source/20200306/C422600_1E6D84923E4A46A82E41ADD87F860B5C.pdf; Supplier: LCSC; ConvertToPcb: yes; FootprintName: R0402; Type: 厚膜电阻; Temperature Coefficient: ±100ppm/℃; Operating Temperature Range: -55℃~+155℃
R21 R24 R30 R32-R34 = 0603WAF0000T5E: 电阻类型:厚膜电阻;阻值:0Ω;精度:±1%;功率:100mW;最大工作电压:75V;; Manufacturer: UNI-ROYAL(厚声); Symbol: 0402WGF0000TCE; AddInBom: yes; ModelId: fc143cca1e79419f9cd78b61e9279f08; ModelTransform: 31.8897,63.7794,0,90,0,0,0,0,0; Tolerance: ±1%; Power(Watts): 100mW; Overload Voltage (Max): 75V; Device: 0603WAF0000T5E; LCSC Part Name: 0Ω ±1% 100mW 厚膜电阻; ManufacturerPart: 0603WAF0000T5E; Supplier Footprint: 0603; JLCPCB Part Class: Basic Part; Datasheet: https://atta.szlcsc.com/upload/public/pdf/source/20200306/C422600_1E6D84923E4A46A82E41ADD87F860B5C.pdf; Supplier: LCSC; ConvertToPcb: yes; FootprintName: R0603; ModelName: R0603; Type: 厚膜电阻; Operating Temperature Range: -55℃~+155℃
  R21: Value: NC
  R24 R30 R32-R34: SupplierPart: C21189; Value: 0Ω
R22 R23 = 0603WAF5101T5E: 电阻类型:厚膜电阻;阻值:5.1kΩ;精度:±1%;功率:100mW;最大工作电压:75V;温度系数:±100ppm/℃;; Manufacturer: UNI-ROYAL(厚声); AddInBom: yes; ModelId: fc143cca1e79419f9cd78b61e9279f08; ModelTransform: 31.8897,63.7794,0,90,0,0,0,0,0; Tolerance: ±1%; Power(Watts): 100mW; Overload Voltage (Max): 75V; Symbol: 0603WAF5101T5E; Device: 0603WAF5101T5E; LCSC Part Name: 5.1kΩ ±1% 100mW 厚膜电阻; SupplierPart: C23186; ManufacturerPart: 0603WAF5101T5E; Supplier Footprint: 0603; JLCPCB Part Class: 基础库; Datasheet: https://atta.szlcsc.com/upload/public/pdf/source/20200306/C422600_1E6D84923E4A46A82E41ADD87F860B5C.pdf; Supplier: LCSC; ConvertToPcb: yes; FootprintName: R0603; ModelName: R0603; Type: 厚膜电阻; Value: 5.1kΩ; Temperature Coefficient: ±100ppm/℃; Operating Temperature Range: -55℃~+155℃
R25 = 0603WAF1001T5E: 电阻类型:厚膜电阻;阻值:1kΩ;精度:±1%;功率:100mW;最大工作电压:75V;温度系数:±100ppm/℃;; Manufacturer: UNI-ROYAL(厚声); Convert to PCB: no; AddInBom: yes; ModelId: fc143cca1e79419f9cd78b61e9279f08; ModelTransform: 31.8897,63.7794,0,90,0,0,0,0,0; Tolerance: ±1%; Power(Watts): 100mW; Overload Voltage (Max): 75V; Symbol: 0603WAF1001T5E; Device: 0603WAF1001T5E; LCSC Part Name: 1kΩ ±1% 100mW 厚膜电阻; SupplierPart: C21190; ManufacturerPart: 0603WAF1001T5E; Supplier Footprint: 0603; JLCPCB Part Class: Basic Part; Datasheet: https://atta.szlcsc.com/upload/public/pdf/source/20200306/C422600_1E6D84923E4A46A82E41ADD87F860B5C.pdf; Supplier: LCSC; FootprintName: R0603; ModelName: R0603; Type: 厚膜电阻; Value: 1kΩ; Temperature Coefficient: ±100ppm/℃; Operating Temperature Range: -55℃~+155℃
R26 = 0603WAF1002T5E: 电阻类型:厚膜电阻;阻值:10kΩ;精度:±1%;功率:100mW;最大工作电压:75V;温度系数:±100ppm/℃;; Manufacturer: UNI-ROYAL(厚声); Convert to PCB: no; AddInBom: yes; ModelId: fc143cca1e79419f9cd78b61e9279f08; ModelTransform: 31.8897,63.7794,0,90,0,0,0,0,0; Tolerance: ±1%; Power(Watts): 100mW; Overload Voltage (Max): 75V; Symbol: 0603WAF1002T5E; Device: 0603WAF1002T5E; LCSC Part Name: 厚膜电阻 10kΩ ±1% 100mW; SupplierPart: C25804; ManufacturerPart: 0603WAF1002T5E; Supplier Footprint: 0603; JLCPCB Part Class: Basic Part; Datasheet: https://atta.szlcsc.com/upload/public/pdf/source/20200306/C422600_1E6D84923E4A46A82E41ADD87F860B5C.pdf; Supplier: LCSC; FootprintName: R0603; ModelName: R0603; Type: 厚膜电阻; Value: 10kΩ; Temperature Coefficient: ±100ppm/℃; Operating Temperature Range: -55℃~+155℃
R27 = 0603WAF470KT5E: 电阻类型:厚膜电阻;阻值:4.7Ω;精度:±1%;功率:100mW;最大工作电压:75V;温度系数:±400ppm/℃;; Manufacturer: UNI-ROYAL(厚声); Convert to PCB: no; AddInBom: yes; ModelId: fc143cca1e79419f9cd78b61e9279f08; ModelTransform: 31.8897,63.7794,0,90,0,0,0,0,0; Tolerance: ±1%; Power(Watts): 100mW; Overload Voltage (Max): 75V; Symbol: 0603WAF470KT5E; Device: 0603WAF470KT5E; LCSC Part Name: 4.7Ω ±1% 100mW 厚膜电阻; SupplierPart: C23164; ManufacturerPart: 0603WAF470KT5E; Supplier Footprint: 0603; JLCPCB Part Class: 基础库; Datasheet: https://atta.szlcsc.com/upload/public/pdf/source/20200306/C422600_1E6D84923E4A46A82E41ADD87F860B5C.pdf; Supplier: LCSC; FootprintName: R0603; ModelName: R0603; Type: 厚膜电阻; Value: 4.7Ω; Temperature Coefficient: ±400ppm/℃; Operating Temperature Range: -55℃~+155℃
SCREW1 SCREW2 = M3螺丝: ConvertToPcb: yes; SymbolName: 螺丝孔; Device: M3螺丝; AddInBom: yes; Supplier Footprint: 插件; FootprintName: M3螺丝
SW1-SW3 = TS-1087B-B2D2: 电路结构:单刀单掷;按钮形状:矩形按钮;作用力:180gf;安装方式:-;开关高度:3.5mm;带灯:-;机械寿命:-;; Manufacturer: Yuandi(元迪); AddInBom: yes; ModelId: 91446138b2014542b180df5ee4dd8126; ModelName: KEY-SMD_L7.6-W3.5-H3.5-P4.2; ModelTransform: 307.086,145.669,0,180,0,0,0,18.433,-31.496; Circuit: 单刀单掷; Actuator Style: 矩形按钮; Operating Force: 180gf; Switch Height: 3.5mm; Symbol: TS-1087B-B2D2; Device: TS-1087B-B2D2; LCSC Part Name: 轻触开关7.0*2.3*3.5有柱黑柄侧按侧贴180gf; SupplierPart: C498303; ManufacturerPart: TS-1087B-B2D2; Supplier Footprint: -; JLCPCB Part Class: 扩展库; Datasheet: https://atta.szlcsc.com/upload/public/pdf/source/20200318/C498302_5CF788D07D014771B0E800D7BCB3EFA7.pdf; Supplier: LCSC; ConvertToPcb: yes; FootprintName: KEY-SMD_4P-L7.8-W2.8-P4.20-EH; Mounting Style: -; With Lamp: -; Mechanical Life: -
SW4 = TS-1087B-B2D2: 电路结构:单刀单掷;按钮形状:矩形按钮;作用力:180gf;安装方式:-;开关高度:3.5mm;带灯:-;机械寿命:-;; Manufacturer: Yuandi(元迪); Symbol: TS-1087B-B3D2; AddInBom: yes; ModelId: 91446138b2014542b180df5ee4dd8126; ModelName: KEY-SMD_L7.6-W3.5-H3.5-P4.2; ModelTransform: 307.086,145.669,0,180,0,0,0,18.433,-31.496; Circuit: 单刀单掷; Actuator Style: 矩形按钮; Operating Force: 180gf; Switch Height: 3.5mm; JLCPCB Part Class: Extended Part; Device: TS-1087B-B2D2; LCSC Part Name: 轻触开关7.0*2.3*3.5有柱黑柄侧按侧贴180gf; SupplierPart: C498303; ManufacturerPart: TS-1087B-B2D2; Supplier Footprint: -; Datasheet: https://atta.szlcsc.com/upload/public/pdf/source/20200318/C498302_5CF788D07D014771B0E800D7BCB3EFA7.pdf; Supplier: LCSC; ConvertToPcb: yes; FootprintName: KEY-SMD_4P-L7.8-W2.8-P4.20-EH; Mounting Style: -; With Lamp: -; Mechanical Life: -
SW5 SW6 = TC-S3403-2.0-260G: 电路结构:单刀单掷;按钮形状:圆形按钮;作用力:2.6N;安装方式:立贴;开关长度:3.95mm;开关宽度:3mm;开关高度:2mm;带支架:不带;触点电流:50mA;额定电压(AC):-;额定电压(DC):12V;绝缘电阻:100MΩ;带灯:无;机械寿命:5万次;; Manufacturer: HCTL(华灿天禄); AddInBom: yes; ModelId: edae6497cb804c2ba2c787d1b5f79afb; ModelName: SW-SMD_L4.0-W3.0-H2-LS5.0; ModelTransform: 196.85,118.11,0,0,0,0,0,0,0; Circuit: 单刀单掷; Actuator Style: 圆形按钮; Operating Force: 2.6N; Switch Length: 3.95mm; Switch Width: 3mm; Switch Height: 2mm; Strike Gundam: 不带; Contact Current: 50mA; Voltage Rating (DC): 12V; Insulation Resistance: 100MΩ; Actuator/Cap Color: 黑色; With Lamp: 无; Mechanical Life: 5万次; Symbol: TC-S3403-2.0-260G; Device: TC-S3403-2.0-260G; LCSC Part Name: TC-S3403-2.0-260G; SupplierPart: C5372844; ManufacturerPart: TC-S3403-2.0-260G; Supplier Footprint: SMD; JLCPCB Part Class: Extended Part; Datasheet: https://atta.szlcsc.com/upload/public/pdf/source/20230320/549E467C3F97F31F1E4EF0A0B79060CE.pdf; Supplier: LCSC; ConvertToPcb: yes; FootprintName: SW-SMD_L4.0-W3.0-LS5.0; Mounting Style: 立贴; Voltage Rating (AC): -; Operating Temperature: -25℃~+70℃
TF1 = TF-015_C410351: 卡连接方式:自弹式;卡类型:MicroSD卡(TF卡);连接器类型:卡座;本体最大高度:2mm;触头镀层:金;工作温度范围:-25℃~+85℃;; Manufacturer: HANBO(汉博); AddInBom: yes; ModelId: 5b4be50223494db9bf5c92b2cb3c1375; ModelName: TF-SMD_L14.8-W14.5-H1.9-P1.1; ModelTransform: 629.92,600.393,0,0,0,0,0.69,-68.901,-19.685; Card Connection Mode: 自弹式; Connector Type: 卡座; Maximum Body Height: 2mm; JLCPCB Part Class: Extended Part; Symbol: TF-015_C410351; Device: TF-015_C410351; LCSC Part Name: 自弹式 MicroSD卡(TF卡) 卡座; SupplierPart: C410351; ManufacturerPart: TF-015; Supplier Footprint: SMD; Datasheet: https://atta.szlcsc.com/upload/public/pdf/source/20221111/DBC20E7A46F16470A0FE17C2BA233463.pdf; Supplier: LCSC; ConvertToPcb: yes; FootprintName: TF-SMD_TF-015; Card Type: MicroSD卡(TF卡); Contact Plating: 金; Operating Temperature Range: -25℃~+85℃
TP1-TP4 = Test-Point: Test Point 测试点; AddInBom: yes; Device: Test-Point; ConvertToPcb: yes; SymbolName: Test-Point; FootprintName: Test-Point-0.5mm
U1 = ESP32-S3-WROOM-1-N16R8: Manufacturer: ESPRESSIF(乐鑫); Symbol: ESP32-S3-WROOM-1(N16R8); AddInBom: yes; ModelId: 481f5bdfc076422c9bb3c23c3ada9c17; ModelTransform: 708.73866,1003.97437,0,0,0,0,0,143.7,0; Device: ESP32-S3-WROOM-1-N16R8; LCSC Part Name: 通用型Wi-Fi+低功耗蓝牙MCU模组; SupplierPart: C2913202; ManufacturerPart: ESP32-S3-WROOM-1-N16R8; Supplier Footprint: SMD,18x25.5mm; JLCPCB Part Class: 扩展库; Datasheet: https://atta.szlcsc.com/upload/public/pdf/source/20220705/4E799F39581577F766659887F738A439.pdf; Supplier: LCSC; ConvertToPcb: yes; FootprintName: WIRELM-SMD_ESP32-S3-WROOM-1; ModelName: WIRELM-SMD_ESP32-S3-WROOM-1
U2 = ME6211C33M5G-N: 输出类型:固定;工作电压:6V;输出电压:3.3V;输出电流:500mA;电源纹波抑制比(PSRR):70dB@(1kHz)；62dB@(10kHz);输出极性:正极;; Manufacturer: MICRONE(南京微盟); AddInBom: yes; ModelId: 0a2a1b8f50944f73965918ad6e5fe167; ModelName: SOT-23-5_L2.9-W1.6-H1.1-LS2.8-P0.95; ModelTransform: 118.60433,114.173,0,90,0,0,0.0005,0.0005,0; Output Type: 固定; Voltage - Supply: 6V; Output Voltage: 3.3V; Output Current: 500mA; Voltage Dropout: 260mV@(200mA); Output Configuration: 正极; Number of Outputs: 1; Symbol: ME6211C33M5G-N; Device: ME6211C33M5G-N; LCSC Part Name: 输入6V 输出3.3V 500mA; SupplierPart: C82942; ManufacturerPart: ME6211C33M5G-N; Supplier Footprint: SOT-23-5; JLCPCB Part Class: 扩展库; Datasheet: https://atta.szlcsc.com/upload/public/pdf/source/20170918/C82942_1505727073070976520.pdf; Supplier: LCSC; ConvertToPcb: yes; FootprintName: SOT-23-5_L3.0-W1.7-P0.95-LS2.8-BL; Power Supply Rejection Ratio (PSRR): 70dB@(1kHz)；62dB@(10kHz); Features: 短路保护(SCP)；低ESR；过流保护(OCP)；带使能
U3 = ICS-43434_C5656610: 方向:全指向;信噪比:64dB;灵敏度:-;; Manufacturer: TDK InvenSense(应美盛); AddInBom: yes; ModelId: 25efa4d3d354448984f6203642365041; ModelTransform: 104.3305,137.795,0,90,0,0,3.197,-0.001,0; Direction: 全指向; Supply Voltage: 1.65V~3.63V; Current Consumption: 550uA; SNR(Signal to Noise Ratio): 64dB; Symbol: ICS-43434_C5656610; Device: ICS-43434_C5656610; LCSC Part Name: ICS-43434; SupplierPart: C5656610; ManufacturerPart: ICS-43434; Supplier Footprint: -; JLCPCB Part Class: 扩展库; Datasheet: https://atta.szlcsc.com/upload/public/pdf/source/231023/DS-000069-ICS-43434-v1.2-8194c7772d771e21a553109502704f97.pdf; Supplier: LCSC; ConvertToPcb: yes; FootprintName: MIC-SMD_6P-L3.5-W2.7-P0.90-BL; ModelName: MIC-SMD_6P-L3.5-W2.7-P0.90-BL; Sensitivity: -
U4 = TP4056_C725790: Manufacturer: UMW(友台半导体); Symbol: TP4056M; AddInBom: yes; ModelId: d3e00daa36c445139c055a3b9efb85d2; ModelName: ESOP-8_L4.9-W3.9-H1.6-LS6.0-P1.27; ModelTransform: 240.157,192.913,0,90,0,0,0,0,0; Battery Chemistry: -; Number of Cells: -; Charge Current - Max: -; Battery Pack Voltage: -; Voltage - Supply (Max): -; Interface: -; Device: TP4056_C725790; LCSC Part Name: TP4056; SupplierPart: C725790; ManufacturerPart: TP4056; Supplier Footprint: ESOP-8; JLCPCB Part Class: Extended Part; Datasheet: https://atta.szlcsc.com/upload/public/pdf/source/20231109/CF74897CE79A500F7FE27A45ADCCC631.pdf; Supplier: LCSC; ConvertToPcb: yes; FootprintName: ESOP-8_L4.9-W3.9-P1.27-LS6.0-BL-EP
U5 = EC190708: 开关机芯片; AddInBom: yes; ModelId: 18da8f6c14a34920b3e136b5c401a119; ModelName: SOT-23-6_L2.9-W1.6-H1.5-LS2.8-P0.95; ModelTransform: 110.236,113.364,0,90,0,0,0.0005,0.0005,0; Interface: I2C; Number of Channels: 1; Output Type: 电压-缓冲; Supply Voltage: 2.7V~5.5V; Resolution: 12; Integral nonlinearity: ±2LSB; Settling Time: 6us; Device: EC190708; LCSC Part Name: EC190708; Manufacturer: EC190708; ManufacturerPart: EC190708; Supplier Footprint: SOT-23-6; JLCPCB Part Class: 扩展库; Datasheet: https://atta.szlcsc.com/upload/public/pdf/source/20180115/C144198_15159965569901268427.pdf; Supplier: LCSC; ConvertToPcb: yes; SymbolName: EC190708; FootprintName: SOT-23-6_L2.9-W1.6-P0.95-LS2.8-BL; Operating Temperature: -40℃~+125℃
USB1 = TYPEC-304-BCP16: 连接器类型:Type-C;标准:USB 3.1;公母:母座;触点数量:16.0;端口数量:1;安装方式:卧贴;额定电流 - 电源:3A;工作温度范围:-25~+85;焊接温度(最大值):260;; Manufacturer: XUNPU(讯普); Welding Temperature (Max): 260; Check: false; AddInBom: yes; ModelId: bb1eabbfbdeb4e438a7034f2ad448367; ModelTransform: 352,305.1,0,0,0,0,0,-47.6,-39.4; Gender: 母座; Number of Contacts: 16.0; Number of Ports: 1; Mounting Sytle: 卧贴; Current Rating - Power (Max): 3A; Device: TYPEC-304-BCP16; Operating Temperature Range: -25~+85; Symbol: TYPEC-304-BCP16; LCSC Part Name: TYPEC-304-BCP16; SupplierPart: C720629; ManufacturerPart: TYPEC-304-BCP16; Supplier Footprint: SMD; JLCPCB Part Class: Extended Part; Datasheet: https://atta.szlcsc.com/upload/public/pdf/source/20211022/DACD6552F639E9483017DE6DC0E61150.pdf; Supplier: LCSC; ConvertToPcb: yes; FootprintName: USB-C-SMD_TYPEC-304-BCP16; ModelName: USB-C-SMD_TYPEC-304-BCP16; Connector Type: Type-C; Standard: USB 3.1